# Altium schematic sheet Ethernet.SchDoc
size A4; Revision: C.2(PCB.SCH)
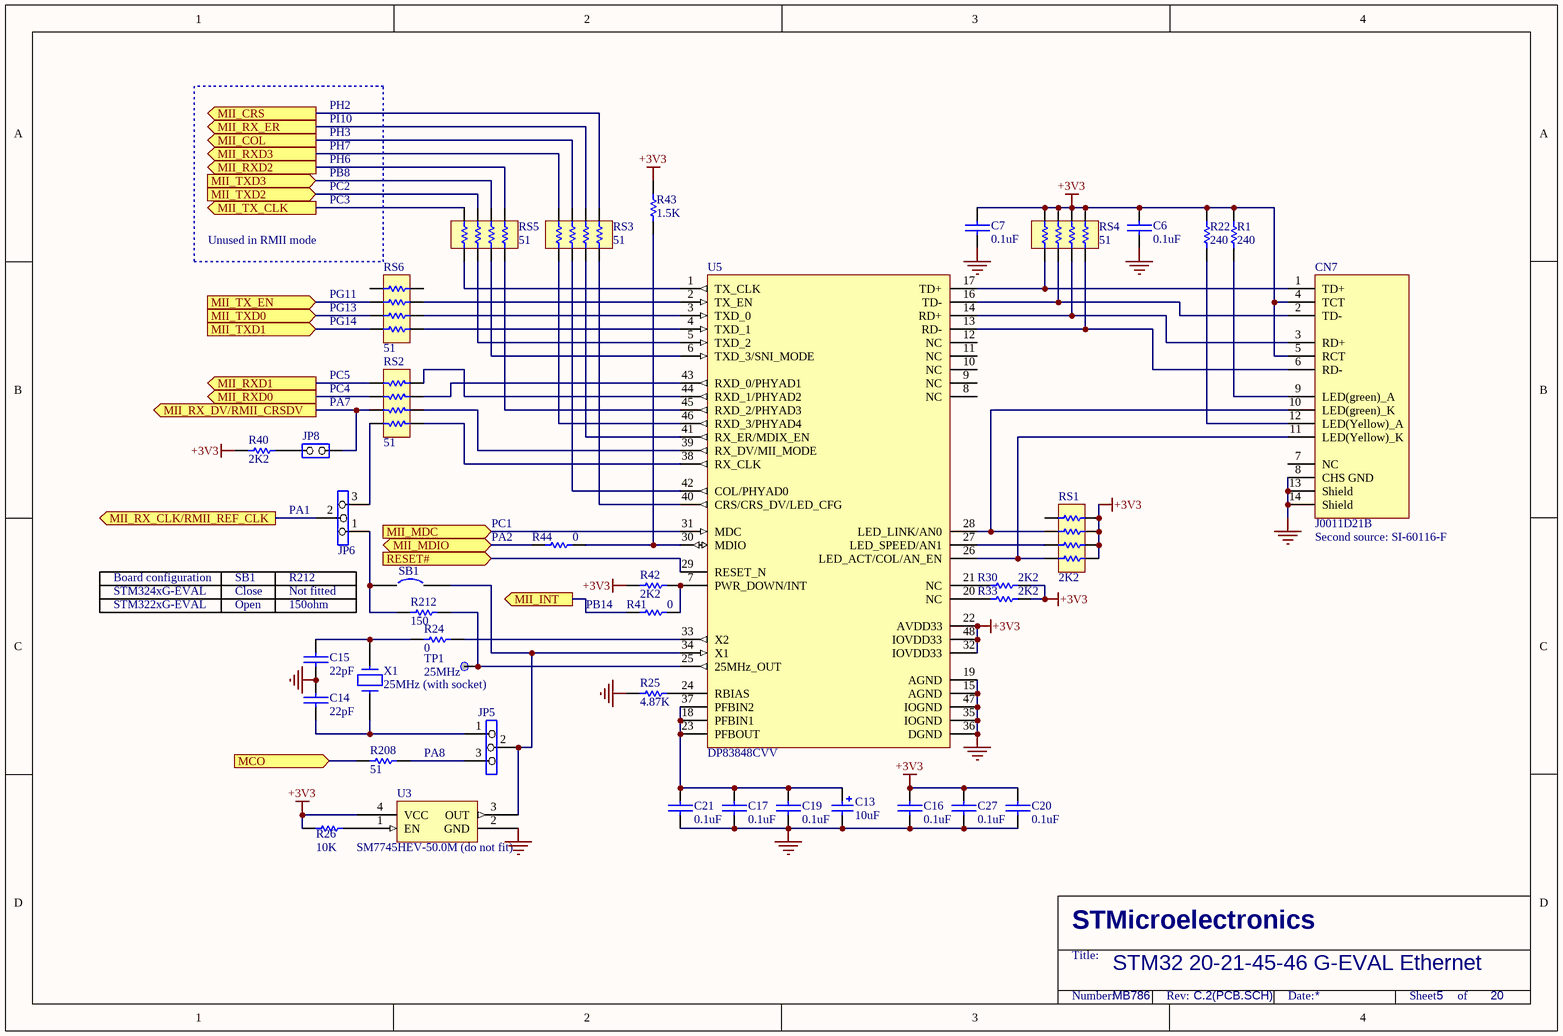
[diagram p0: Ethernet.SchDoc]

## Parts
C6  0.1uF  [0402C]
C7  0.1uF  [0402C]
C13  10uF  [TAN-A]
C14  22pF  [0603C]
C15  22pF  [0603C]
C16  0.1uF  [0402C]
C17  0.1uF  [0402C]
C19  0.1uF  [0402C]
C20  0.1uF  [0402C]
C21  0.1uF  [0402C]
C27  0.1uF  [0402C]
CN7  J0011D21B  [J0011D21B]
JP5  (no value)  [SIP3]
JP6  (no value)  [SIP3]
JP8  (no value)  [SIP2]
R1  240  [0603R]
R22  240  [0603R]
R24  0  [0603R]
R25  4.87K  [0603R]
R26  10K  [0402R]
R30  2K2  [0603R]
R33  2K2  [0603R]
R40  2K2  [0603R]
R41  0  [0603R]
R42  2K2  [0603R]
R43  1.5K  [0603R]
R44  0  [0603R]
R208  51  [0603R]
R212  150  [0603R]
RS1  2K2  [RES4B]
RS2  51  [RES4B]
RS3  51  [RES4B]
RS4  51  [RES4B]
RS5  51  [RES4B]
RS6  51  [RES4B]
SB1  (no value)  [JP2_SMD]
TP1  25MHz  [TP]
U3  SM7745HEV-50.0M (do not fit)  [XTAL_5X7]
U5  DP83848CVV  [LQFP48]
X1  25MHz (with socket)  [XTAL_socket]

## Ports
MCO (in), MII_COL (out), MII_CRS (out), MII_INT (out), MII_MDC (in), MII_MDIO (bidir), MII_RX_CLK/RMII_REF_CLK (out), MII_RX_DV/RMII_CRSDV (out), MII_RX_ER (out), MII_RXD0 (out), MII_RXD1 (out), MII_RXD2 (out), MII_RXD3 (out), MII_TX_CLK (out), MII_TX_EN (in), MII_TXD0 (in), MII_TXD1 (in), MII_TXD2 (in), MII_TXD3 (in), RESET# (in)

## Nets
+3V3: C6.2 C7.2 C16.1 C20.2 C27.2 CN7.4(TCT) CN7.5(RCT) R1.2 R22.2 R26.1 R30.2 R33.2 R40.2 R42.1 R43.2 RS1.1 RS1.3 RS1.5 RS1.7 RS4.1 RS4.3 RS4.5 RS4.7 U3.4(VCC) U5.22(AVDD33) U5.32(IOVDD33) U5.48(IOVDD33)
GND: C6.1 C7.1 C13.2 C14.2 C15.1 C16.2 C17.1 C19.1 C20.1 C21.2 C27.1 CN7.8(CHS_GND) CN7.13(Shield) CN7.14(Shield) R25.1 U3.2(GND) U5.15(AGND) U5.19(AGND) U5.35(IOGND) U5.36(DGND) U5.47(IOGND)
MCO: R208.2 ; port MCO
MII_COL: RS3.4 ; port MII_COL
MII_CRS: RS3.8 ; port MII_CRS
MII_INT: R41.1 ; port MII_INT
MII_MDC: U5.31(MDC) ; port MII_MDC
MII_MDIO: R44.1 ; port MII_MDIO
MII_RX_CLK/RMII_REF_CLK: JP6.2 ; port MII_RX_CLK/RMII_REF_CLK
MII_RX_DV/RMII_CRSDV: JP8.1(COMMON) RS2.6 ; port MII_RX_DV/RMII_CRSDV
MII_RX_ER: RS3.6 ; port MII_RX_ER
MII_RXD0: RS2.4 ; port MII_RXD0
MII_RXD1: RS2.2 ; port MII_RXD1
MII_RXD2: RS5.8 ; port MII_RXD2
MII_RXD3: RS3.2 ; port MII_RXD3
MII_TX_CLK: RS5.2 ; port MII_TX_CLK
MII_TX_EN: RS6.6 ; port MII_TX_EN
MII_TXD0: RS6.4 ; port MII_TXD0
MII_TXD1: RS6.2 ; port MII_TXD1
MII_TXD2: RS5.4 ; port MII_TXD2
MII_TXD3: RS5.6 ; port MII_TXD3
RESET#: U5.29(RESET_N) ; port RESET#
NetC13_1: C13.1 C17.2 C19.2 C21.1 U5.18(PFBIN1) U5.23(PFBOUT) U5.37(PFBIN2)
NetC14_1: C14.1 JP5.1 X1.1
NetC15_2: C15.2 R24.2 X1.2
NetCN7_1: CN7.1(TD+) RS4.8 U5.17(TD+)
NetCN7_2: CN7.2(TD-) RS4.6 U5.16(TD-)
NetCN7_3: CN7.3(RD+) RS4.4 U5.14(RD+)
NetCN7_6: CN7.6(RD-) RS4.2 U5.13(RD-)
NetCN7_9: CN7.9(LED(green)_A) R1.1
NetCN7_10: CN7.10(LED(green)_K) RS1.6 U5.28(LED_LINK/AN0)
NetCN7_11: CN7.11(LED(Yellow)_K) RS1.2 U5.26(LED_ACT/COL/AN_EN)
NetCN7_12: CN7.12(LED(Yellow)_A) R22.1
NetJP5_2: JP5.2 SB1.2 U3.3(OUT) U5.34(X1)
NetJP5_3: JP5.3 R208.1
NetJP6_1: JP6.1 R212.2 SB1.1
NetJP6_3: JP6.3 RS2.8
NetJP8_2: JP8.2(NO) R40.1
NetR24_1: R24.1 U5.33(X2)
NetR25_2: R25.2 U5.24(RBIAS)
NetR26_2: R26.2 U3.1(EN)
NetR30_1: R30.1 U5.21(NC)
NetR33_1: R33.1 U5.20(NC)
NetR41_2: R41.2 R42.2 U5.7(PWR_DOWN/INT)
NetR43_1: R43.1 R44.2 U5.30(MDIO)
NetR212_1: R212.1 TP1.1 U5.25(25MHz_OUT)
NetRS1_4: RS1.4 U5.27(LED_SPEED/AN1)
NetRS2_1: RS2.1 U5.44(RXD_1/PHYAD2)
NetRS2_3: RS2.3 U5.43(RXD_0/PHYAD1)
NetRS2_5: RS2.5 U5.39(RX_DV/MII_MODE)
NetRS2_7: RS2.7 U5.38(RX_CLK)
NetRS3_1: RS3.1 U5.46(RXD_3/PHYAD4)
NetRS3_3: RS3.3 U5.42(COL/PHYAD0)
NetRS3_5: RS3.5 U5.41(RX_ER/MDIX_EN)
NetRS3_7: RS3.7 U5.40(CRS/CRS_DV/LED_CFG)
NetRS5_1: RS5.1 U5.1(TX_CLK)
NetRS5_3: RS5.3 U5.5(TXD_2)
NetRS5_5: RS5.5 U5.6(TXD_3/SNI_MODE)
NetRS5_7: RS5.7 U5.45(RXD_2/PHYAD3)
NetRS6_1: RS6.1 U5.4(TXD_1)
NetRS6_3: RS6.3 U5.3(TXD_0)
NetRS6_5: RS6.5 U5.2(TX_EN)

Not connected (* = marked no-connect by the designer): CN7 7(NC); RS1 8; RS6 7 8; U5 8(NC) 9(NC) 10(NC) 11(NC) 12(NC)

## Notes on the sheet
- PH2
- PI10
- PH3
- PH6
- PH7
- PB8
- Unused in RMII mode
- PC2
- PC3
- (near RS6) PG11
- (near RS6) PG13
- PC5
- (near RS6) PG14
- PA7
- PC4
- (near JP6) PA1
- Board configuration
- SB1
- R212
- (near R44) PC1
- (near R44) PA2
- (near CN7) Second source: SI-60116-F
- STM324xG-EVAL
- STM322xG-EVAL
- Close
- Open
- Not fitted
- (near C15) 150ohm
- PB14
- (near R208) PA8
- STM32 20-21-45-46 G-EVAL Ethernet
- MB786
- 5
- 20
- STMicroelectronics
- Title:
- Number:
- Rev:
- Date:
- Sheet       of

## Library data of the parts
C6 C7 C14-C17 C19-C21 C27 = CAP: Capacitor
C13 = Cap Pol1: Polarized Capacitor (Radial); Published: 8-Jun-2000; Revision: July-2002: Re-released for DXP Platform.; Publisher: Altium Limited; Value: 10uF
JP5 JP6 = Jumper3
JP8 = JP2
R1 R22 R24-R26 R30 R33 R40-R44 R208 R212 = Res1: Resistor; Value: 1K; Published: 8-Jun-2000; Revision: July-2002: Re-released for DXP Platform.; Publisher: Altium Limited
RS1-RS6 = Resister Array
SB1 = Circuit Breaker: Published: 24-Mar-1999; Revision: July-2002: Re-released for DXP Platform.; Publisher: Altium Limited
TP1 = TP
U3 = SM7745HEV-50.0M
X1 = CRYSTAL